# Altium schematic sheet power_supply.SchDoc
size A4; SheetNumber: 6; SheetTotal: 6
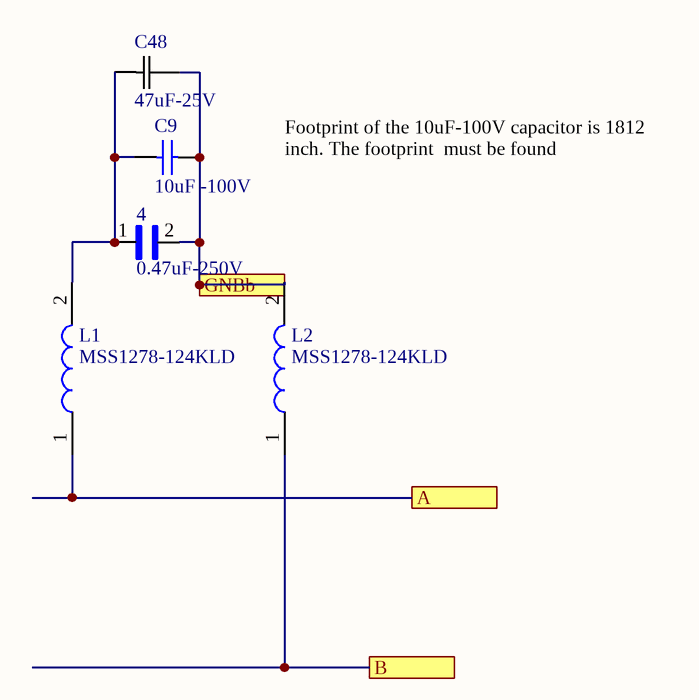
[diagram p0: power_supply.SchDoc]

## Parts
4  0.47uF-250V  [CAPC3326X280N]
C9  value 10uF -100V  (hidden comment: Symbol)
C48  47uF-25V
L1  MSS1278-124KLD  [INDPM120120X805N]
L2  MSS1278-124KLD  [INDPM120120X805N]

## Ports
A, B, GNBb

## Nets
A: L1.1 ; port A
B: L2.1 ; port B
GNBb: 4.2 C9.2 C48.2 L2.2 ; port GNBb
Net4_1: 4.1 C9.1 C48.1 L1.2

## Notes on the sheet
- Footprint of the 10uF-100V capacitor is 1812 inch. The footprint  must be found

## Library data of the parts
4 = CMP-010-000002-1: MF: {'manufacturer': u'KEMET'}; MP: C1210X474KARACAUTO; Value: *; Package: None; Price: None; Availability: Unavailable; Component Type: Standard; Design Item ID: C1210X474KARACAUTO; Pin Count: 2; Source: workerBoard.SCHLIB
C9 = CMP-003-000004-1: Capacitor; SimulationGenericComponent: True; Component Type: Standard; Design Item ID: Capacitor; Pin Count: 2; Source: workerBoard.SCHLIB
C48 = CMP-003-000007-1: No Description Available; Mfr_Name: Murata; Type: DEV; Copyright: Copyright (C) 2021 Ultra Librarian. All rights reserved.; Manufacturer_Part_Number: GRM31CR61E476ME44K; RefDes: RefDes; Component Type: Standard; Design Item ID: GRM31CR61E476ME44K; Pin Count: 2; Source: workerBoard.SCHLIB
L1 L2 = CMP-006-000002-1: Inductor; Manufacturer_Name: COILCRAFT; Datasheet Link: https://componentsearchengine.com/Datasheets/1/MSS1278-124KLD.pdf; Height: 8.05mm; Manufacturer_Part_Number: MSS1278-124KLD; Component Type: Standard; Design Item ID: MSS1278-124KLD; Pin Count: 2; Source: workerBoard.SCHLIB